# EasyEDA Pro project 最小系统板.eprj

# Schematic Schematic1
Board Name: Board1; Create Date: 2024-09-01
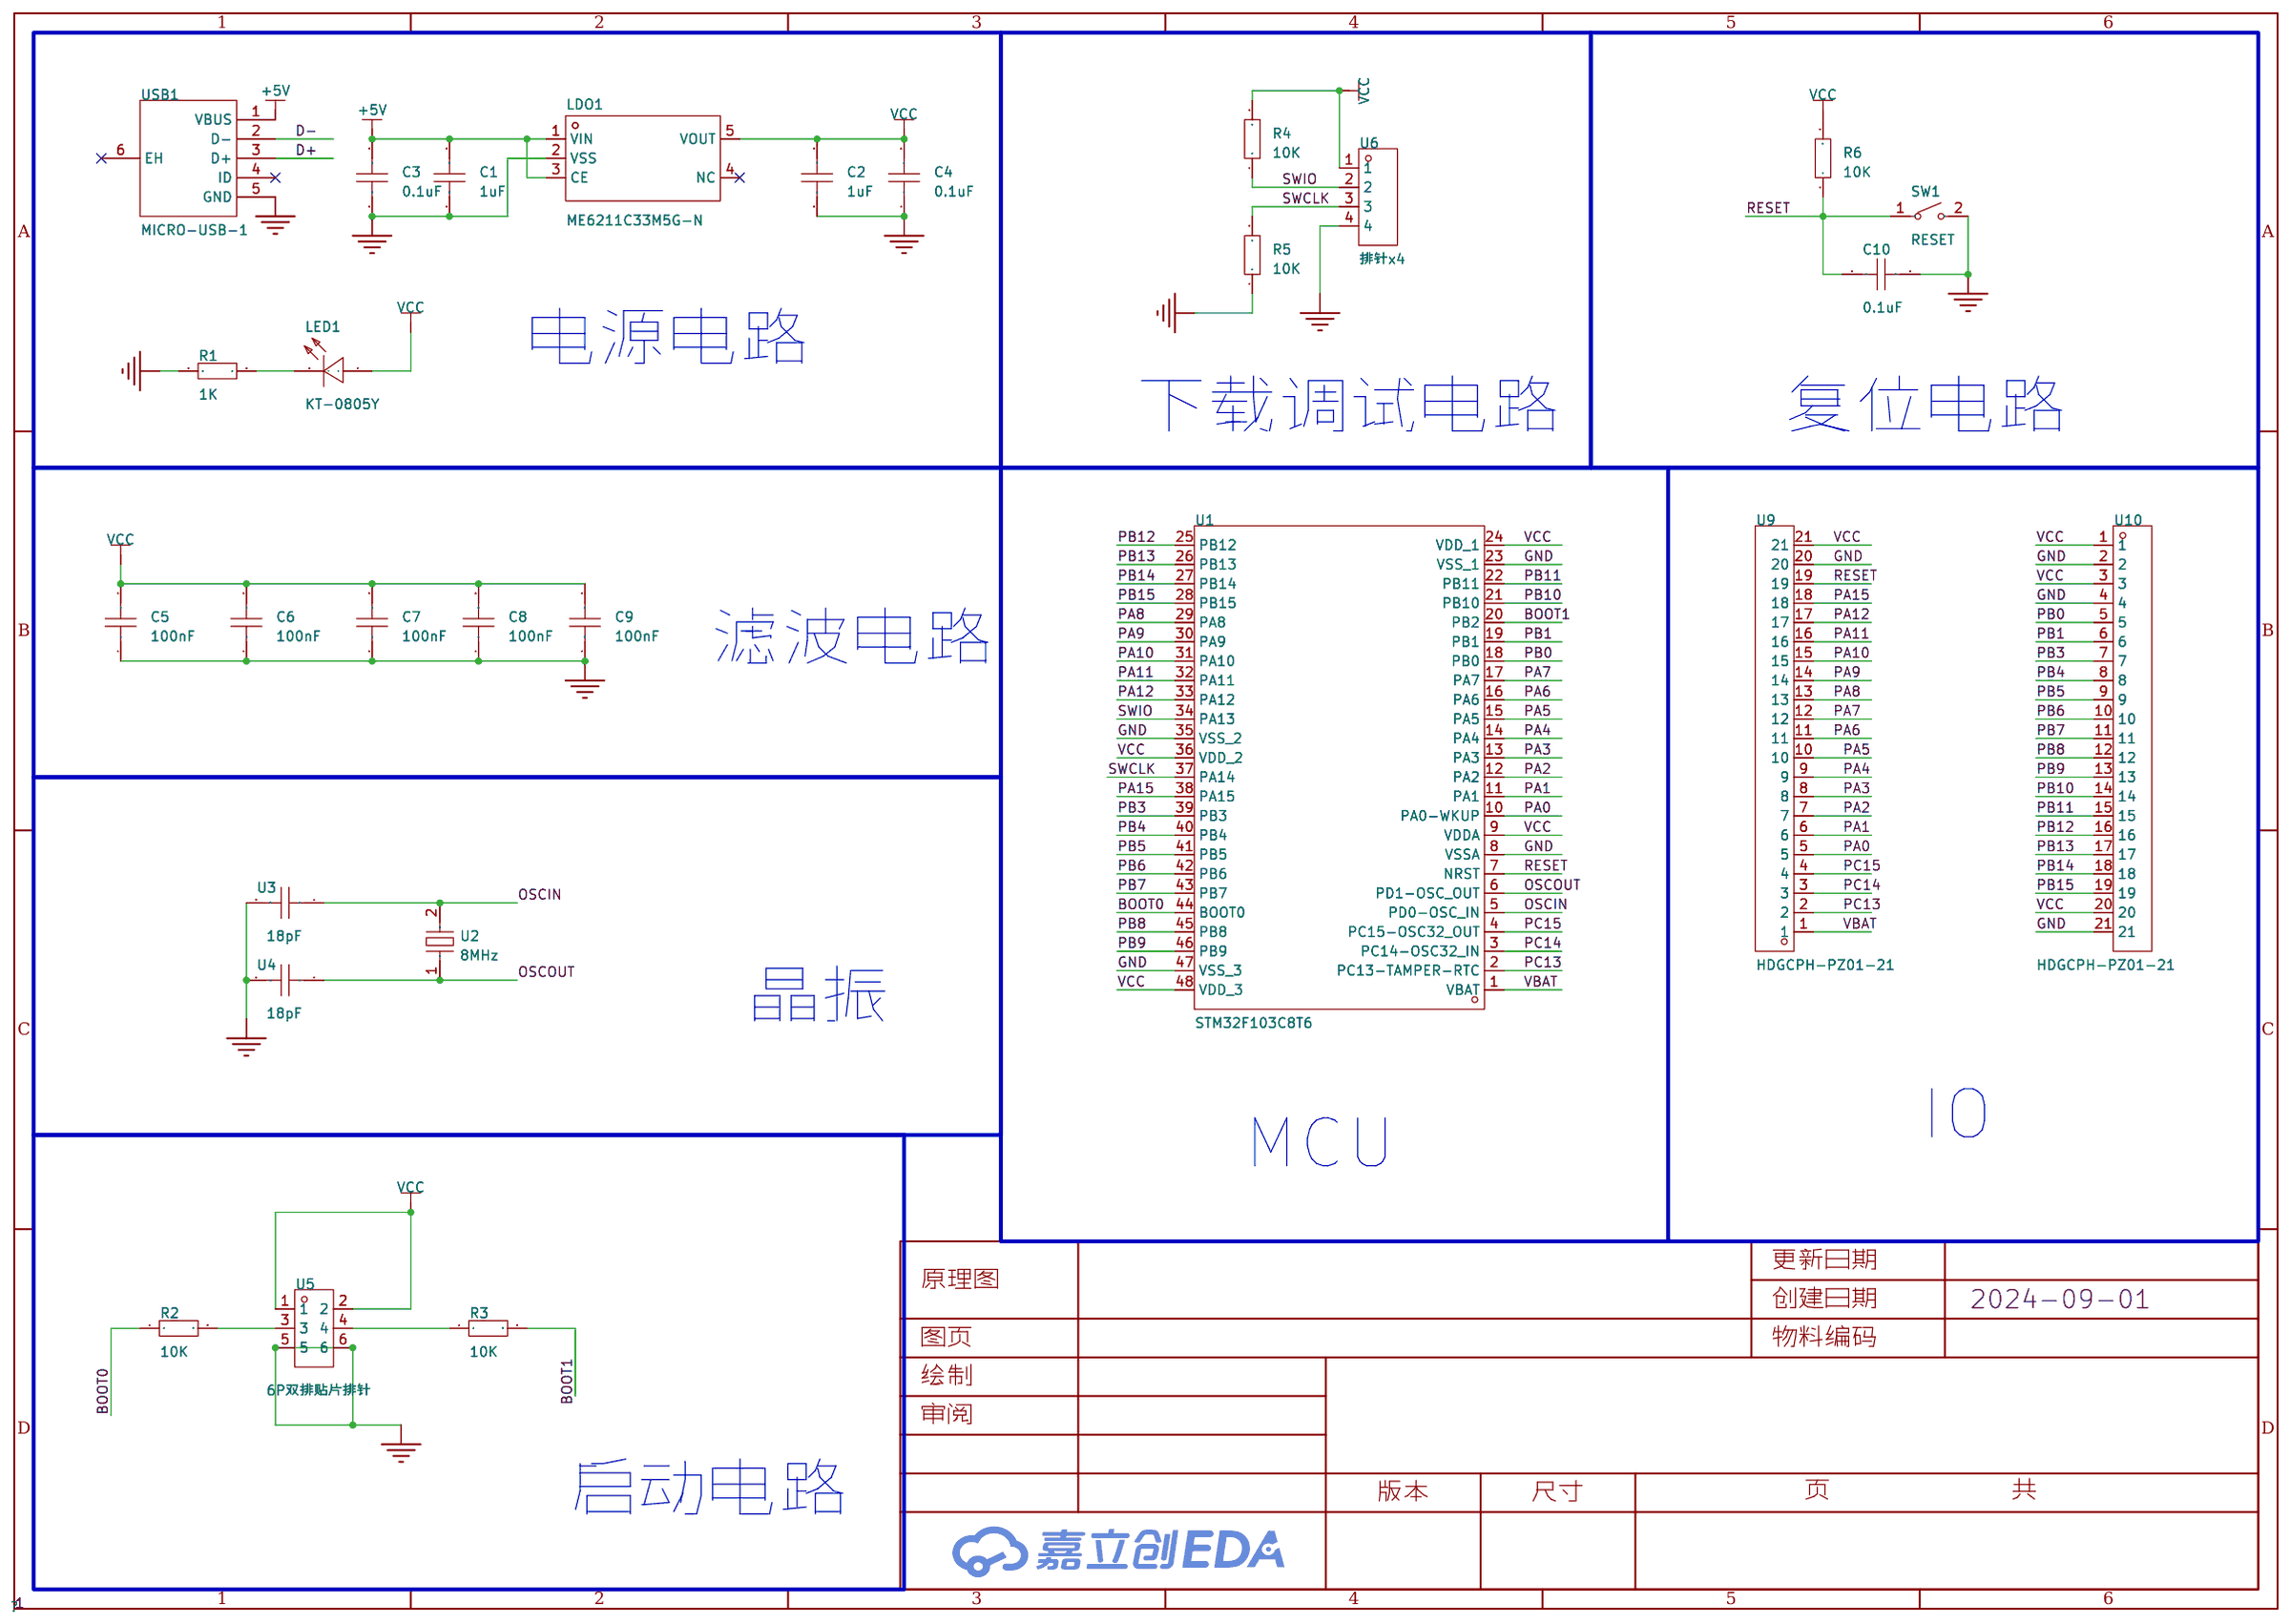
[diagram p0: schematic sheet]

## Parts
C1  1uF  [C0603]
C2  1uF  [C0603]
C3  0.1uF  [C0603]
C4  0.1uF  [C0603]
C5  100nF  [C0603]
C6  100nF  [C0603]
C7  100nF  [C0603]
C8  100nF  [C0603]
C9  100nF  [C0603]
C10  0.1uF  [C0603]
LDO1  ME6211C33M5G-N  [SOT-23-5_L3.0-W1.7-P0.95-LS2.8-BL]
LED1  KT-0805Y  [LED0805-R-RD]
R1  1K  [R0603]
R2  10K  [R0603]
R3  10K  [R0603]
R4  10K  [R0603]
R5  10K  [R0603]
R6  10K  [R0603]
SW1  RESET  [SW-SMD_L6.0-W3.3-LS8.0]
U1  STM32F103C8T6  [LQFP-48_L7.0-W7.0-P0.50-LS9.0-BL]
U2  8MHz  [HC-49S_L10.6-W4.2-P4.85]
U3  18pF  [C0603]
U4  18pF  [C0603]
U5  6P双排贴片排针  [HDR-SMD_6P-P2.54-V-M-R2-C3-LS7.6]
U6  排针x4  [HDR-TH_4P-P2.54-V-M-1]
U9  HDGCPH-PZ01-21  [HDR-TH_21P-P2.54-V-M]
U10  HDGCPH-PZ01-21  [HDR-TH_21P-P2.54-V-M]
USB1  MICRO-USB-1  [MICRO-USB-SMD_C9900008946]

## Library data of the parts
C1 C2 C10 = CL10A105KB8NNNC: LCSC Part Name: 1uF ±10% 50V; Supplier Part: C15849; Manufacturer: SAMSUNG(三星); Supplier Footprint: 0603; JLCPCB Part Class: Basic Part; Datasheet: https://atta.szlcsc.com/upload/public/pdf/source/20160218/1457707763339.pdf; Supplier: LCSC; Tolerance: ±10%; Voltage Rated: 50V; Temperature Coefficient: X5R
C3 C4 U3 U4 = CGJ3E2C0G1H010C080AA: LCSC Part Name: 1pF 50V; Supplier Part: C3903570; Manufacturer: TDK; Supplier Footprint: 0603; JLCPCB Part Class: Extended Part; Datasheet: https://atta.szlcsc.com/upload/public/pdf/source/231023/files-19dba70df95f1e579ee79f9957c4f5cc.pdf; Supplier: LCSC; Voltage Rated: 50V; Temperature Coefficient: C0G
C5-C9 = CAP_0603: Supplier Footprint: 0603
LDO1 = ME6211C33M5G-N: LCSC Part Name: 输入6V 输出3.3V 500mA; Supplier Part: C82942; Manufacturer: MICRONE(南京微盟); Supplier Footprint: SOT-23-5; JLCPCB Part Class: Extended Part; Datasheet: https://atta.szlcsc.com/upload/public/pdf/source/20170918/C82942_1505727073070976520.pdf; Supplier: LCSC; Output Type: 固定; Maximum Input Voltage: 6V; Output Voltage: 3.3V; MAX Output Current: 500mA; Power Supply Rejection Ratio (PSRR): 70dB; Dropout Voltage: 260mV@(200mA); Output Polarity: 正极; Number of Outputs: 1
LED1 = KT-0805Y: LCSC Part Name: 0805 黄灯 高亮; Supplier Part: C2296; Manufacturer: KENTO; Supplier Footprint: 0805; JLCPCB Part Class: Basic Part; Datasheet: https://atta.szlcsc.com/upload/public/pdf/source/20160421/1461205044170.pdf; Supplier: LCSC; Emitted Color: 黄色
R1-R6 = Res_0603: Supplier Footprint: 0603
SW1 = SW_PB2_A1: Supplier Part: C9900015236; Supplier Footprint: SW_3*6*2.5mm; JLCPCB Part Class: Extended Part; Supplier: LCSC
U1 = STM32F103C8T6: LCSC Part Name: 主流增强型ARM Cortex-M3 MCU，具有64 KB Flash、72 MHz CPU、电机控制、USB和CAN; Supplier Part: C8734; Manufacturer: ST(意法半导体); Supplier Footprint: LQFP-48(7x7); JLCPCB Part Class: 扩展库; Datasheet: https://atta.szlcsc.com/upload/public/pdf/source/20220812/8363ACEC51AD55ECEB84799464F7CB85.pdf; Supplier: LCSC; CPU Core: ARM-M3; Program Storage Size: 64KB; RAM Size: 20KB; GPIO Ports Number: 37; Operating Voltage Range: 2V~3.6V; CPU Maximum Speed: 72MHz; Program Memory Type: FLASH; Operating Temperature Range: -40℃~+85℃; ADC (Bit): 12bit; Universal Serial Bus: 有; Peripheral/Function: 看门狗；DMA；看门狗；温度传感器; Watchdog: 有; Infrared Data Association: 有; Low-Voltage Detect: 有; Direct Memory Access: 有; Internal Oscillator: 有
U2 = HY67458M49SOB2T02: LCSC Part Name: 6.7458MHz ±20ppm 20pF; Supplier Part: C5265694; Manufacturer: Huiyuan crystal(惠源晶工); Supplier Footprint: HC-49S; JLCPCB Part Class: Extended Part; Datasheet: https://atta.szlcsc.com/upload/public/pdf/source/20221116/16F0A6FC57BDD74B8F33F5DC37B8BFA5.pdf; Supplier: LCSC; Normal temperature Frequency Tolerance: ±20ppm; External load capacitor: 20pF; Frequency Stability(Full temperature range): ±50ppm; Equivalent Series Resistance (ESR): 80Ω; Operating Temperature: -40℃~+85℃
U5 = 6P双排贴片排针: Supplier Part: C9900024689; Supplier Footprint: 6P_2.54mm; JLCPCB Part Class: 扩展库; Supplier: LCSC
U6 = 排针x4: Supplier Part: C9900018911; Supplier Footprint: CON4; JLCPCB Part Class: 扩展库; Supplier: LCSC
U9 U10 = HDGCPH-PZ01-21: LCSC Part Name: 2.54单排针直插排针L11.6/3.0 1x21P; Supplier Part: C19190987; Manufacturer: HDGC(华德共创); Supplier Footprint: 插件,P=2.54mm; JLCPCB Part Class: Extended Part; Datasheet: https://atta.szlcsc.com/upload/public/pdf/source/20231110/9EB16C2E1D607182756B4718BDE6A9C4.pdf; Supplier: LCSC
USB1 = MICRO-USB-1: Supplier Part: C9900008946; Supplier Footprint: USB-micro; JLCPCB Part Class: Extended Part; Supplier: LCSC

## Nets
+5V: C1.2 C3.2 LDO1.1(VIN) LDO1.3(CE) USB1.1(VBUS)
GND: C1.1 C2.1 C3.1 C4.1 C5.1 C6.1 C7.1 C8.1 C9.1 C10.2 LDO1.2(VSS) R1.1 R5.1 SW1.2 U1.8(VSSA) U1.23(VSS_1) U1.35(VSS_2) U1.47(VSS_3) U3.2 U4.2 U5.5 U5.6 U6.4 U9.20 U10.2 U10.4 U10.21 USB1.5(GND)
VBAT: U1.1(VBAT) U9.1
VCC: C2.2 C4.2 C5.2 C6.2 C7.2 C8.2 C9.2 LDO1.5(VOUT) LED1.1(+) R4.2 R6.2 U1.9(VDDA) U1.24(VDD_1) U1.36(VDD_2) U1.48(VDD_3) U5.1 U5.2 U6.1 U9.21 U10.1 U10.3 U10.20
BOOT0: R2.1 U1.44(BOOT0)
BOOT1: R3.2 U1.20(PB2)
D+: USB1.3(D+)
D-: USB1.2(D-)
OSCIN: U1.5(PD0-OSC_IN) U2.2(GND) U3.1
OSCOUT: U1.6(PD1-OSC_OUT) U2.1 U4.1
PA0: U1.10(PA0-WKUP) U9.5
PA1: U1.11(PA1) U9.6
PA2: U1.12(PA2) U9.7
PA3: U1.13(PA3) U9.8
PA4: U1.14(PA4) U9.9
PA5: U1.15(PA5) U9.10
PA6: U1.16(PA6) U9.11
PA7: U1.17(PA7) U9.12
PA8: U1.29(PA8) U9.13
PA9: U1.30(PA9) U9.14
PA10: U1.31(PA10) U9.15
PA11: U1.32(PA11) U9.16
PA12: U1.33(PA12) U9.17
PA15: U1.38(PA15) U9.18
PB0: U1.18(PB0) U10.5
PB1: U1.19(PB1) U10.6
PB3: U1.39(PB3) U10.7
PB4: U1.40(PB4) U10.8
PB5: U1.41(PB5) U10.9
PB6: U1.42(PB6) U10.10
PB7: U1.43(PB7) U10.11
PB8: U1.45(PB8) U10.12
PB9: U1.46(PB9) U10.13
PB10: U1.21(PB10) U10.14
PB11: U1.22(PB11) U10.15
PB12: U1.25(PB12) U10.16
PB13: U1.26(PB13) U10.17
PB14: U1.27(PB14) U10.18
PB15: U1.28(PB15) U10.19
PC13: U1.2(PC13-TAMPER-RTC) U9.2
PC14: U1.3(PC14-OSC32_IN) U9.3
PC15: U1.4(PC15-OSC32_OUT) U9.4
RESET: C10.1 R6.1 SW1.1 U1.7(NRST) U9.19
SWCLK: R5.2 U1.37(PA14) U6.3
SWIO: R4.1 U1.34(PA13) U6.2
Net-(LED1-2): LED1.2(-) R1.2
Net-(R2-2): R2.2 U5.3
Net-(R3-1): R3.1 U5.4

Not connected (* = marked no-connect by the designer): LDO1 4(NC)*; USB1 4(ID)* 6(EH)*

## Notes on the sheet
- 电源电路
- 下载调试电路
- 复位电路
- 滤波电路
- 晶振
- IO
- MCU
- 启动电路
